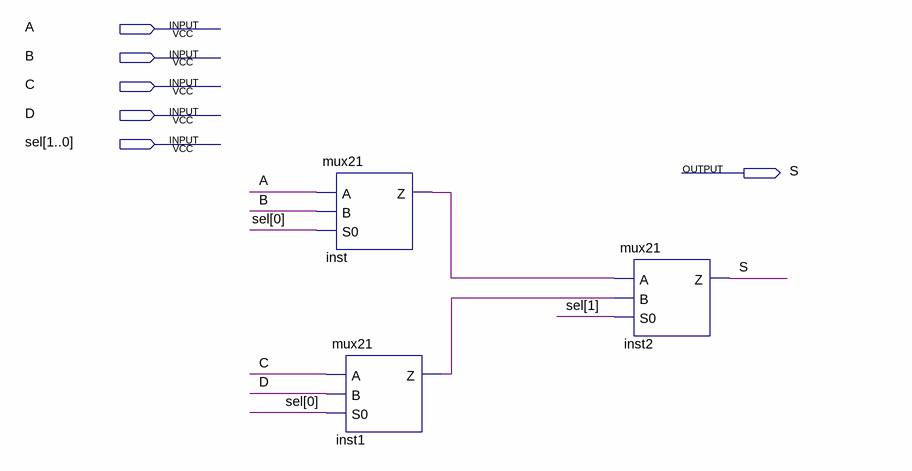
[diagram p0: schematic sheet]
// Quartus schematic mux1bit41.bdf as structural Verilog: 3 symbols, 6 pins
module mux1bit41 (
  input  A,
  input  B,
  input  C,
  input  D,
  input  [1:0] sel,
  output S
);

  wire inst1_z, inst_z;

  mux21 inst (.A(A), .B(B), .S0(sel[0]), .Z(inst_z));
  mux21 inst1 (.A(C), .B(D), .S0(sel[0]), .Z(inst1_z));
  mux21 inst2 (.A(inst_z), .B(inst1_z), .S0(sel[1]), .Z(S));
endmodule
